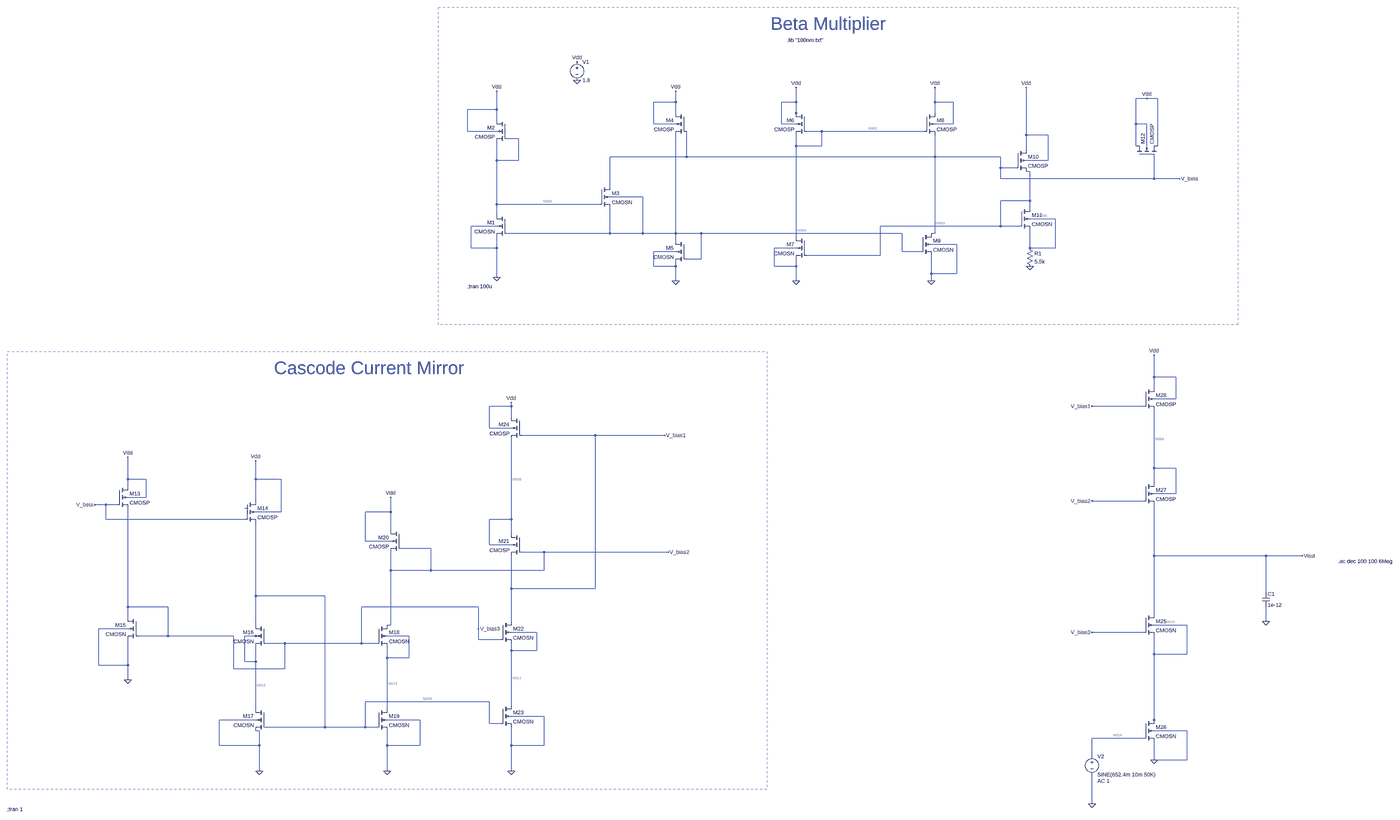
[diagram p0: schematic Vivek_180nm.asc, whole sheet]
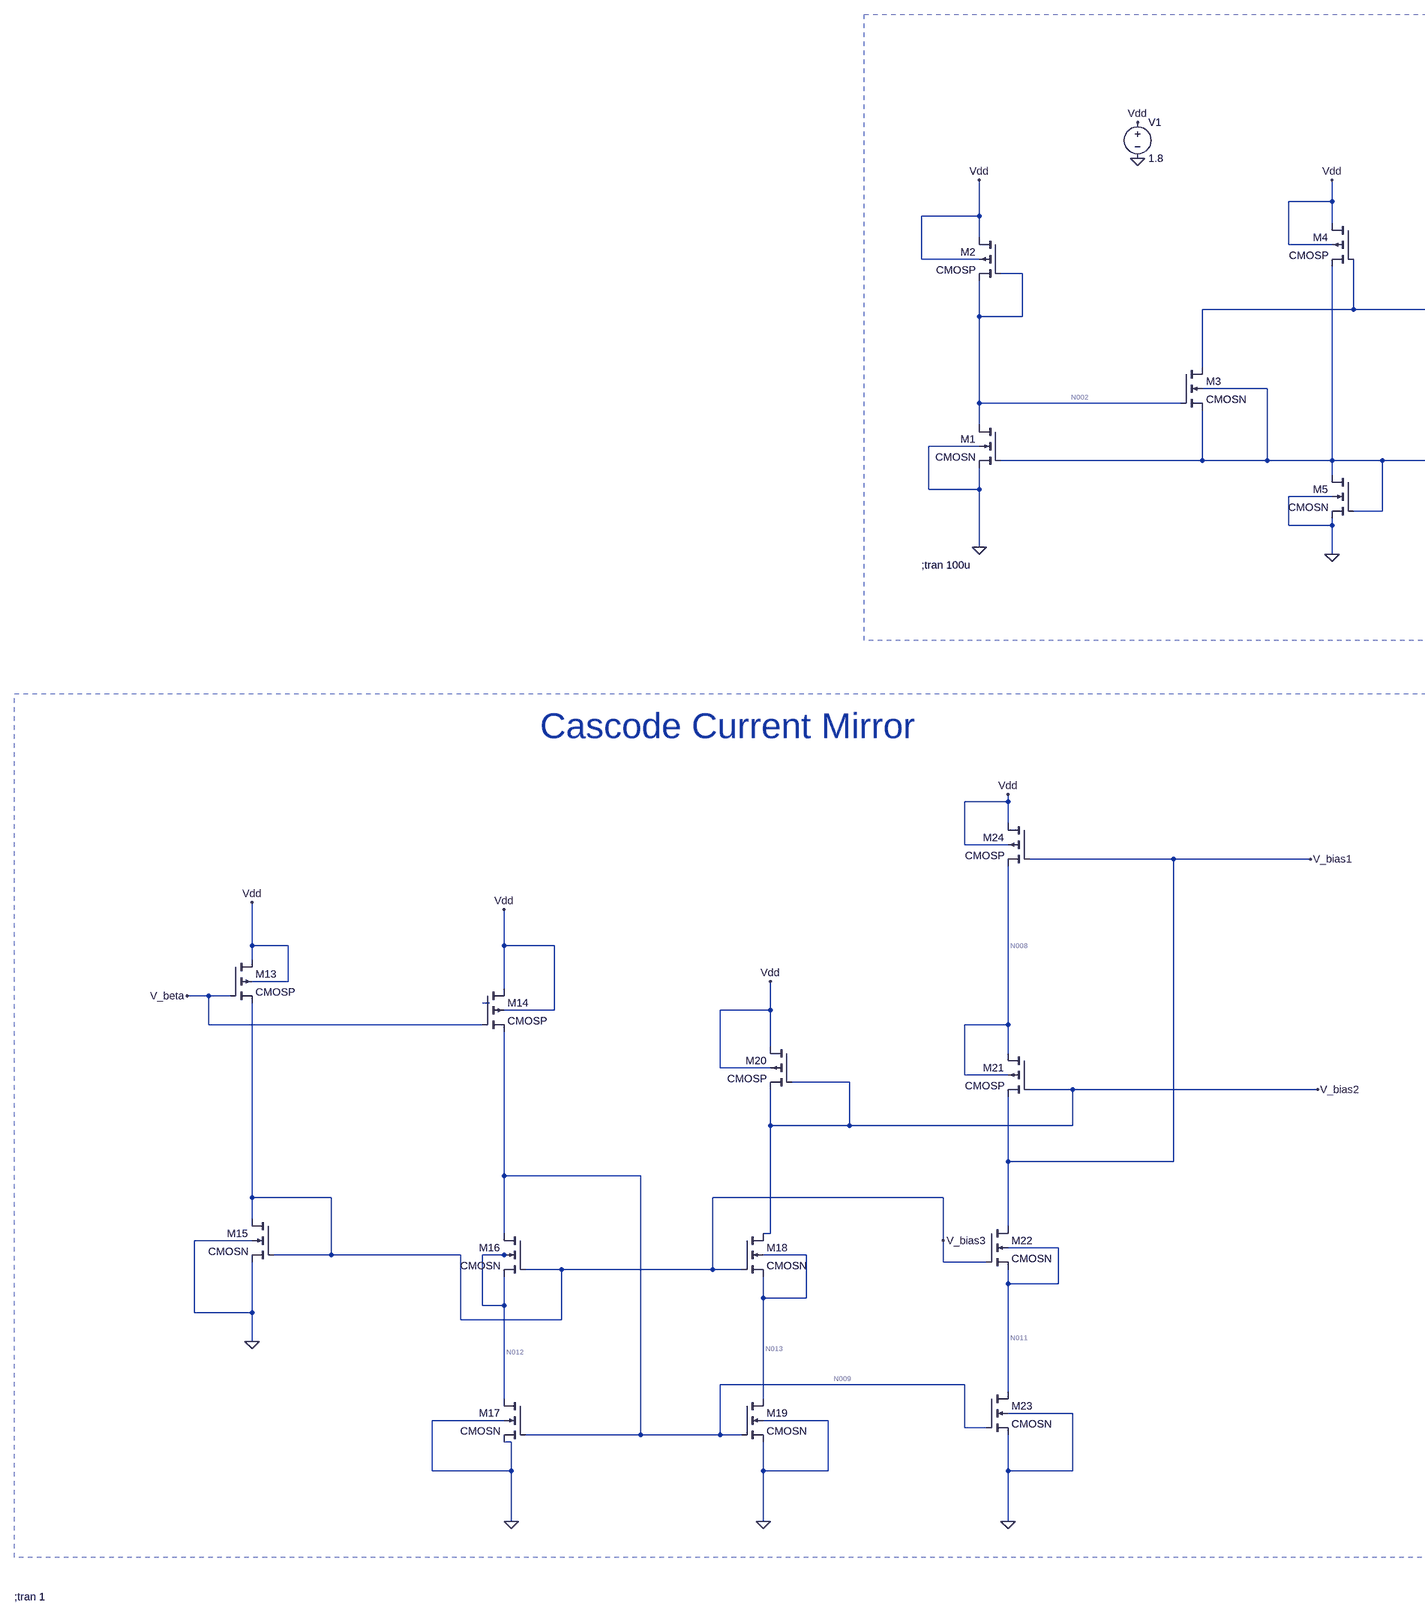
[diagram p1: schematic Vivek_180nm.asc, part, row 1 of 1, column 1 of 2]
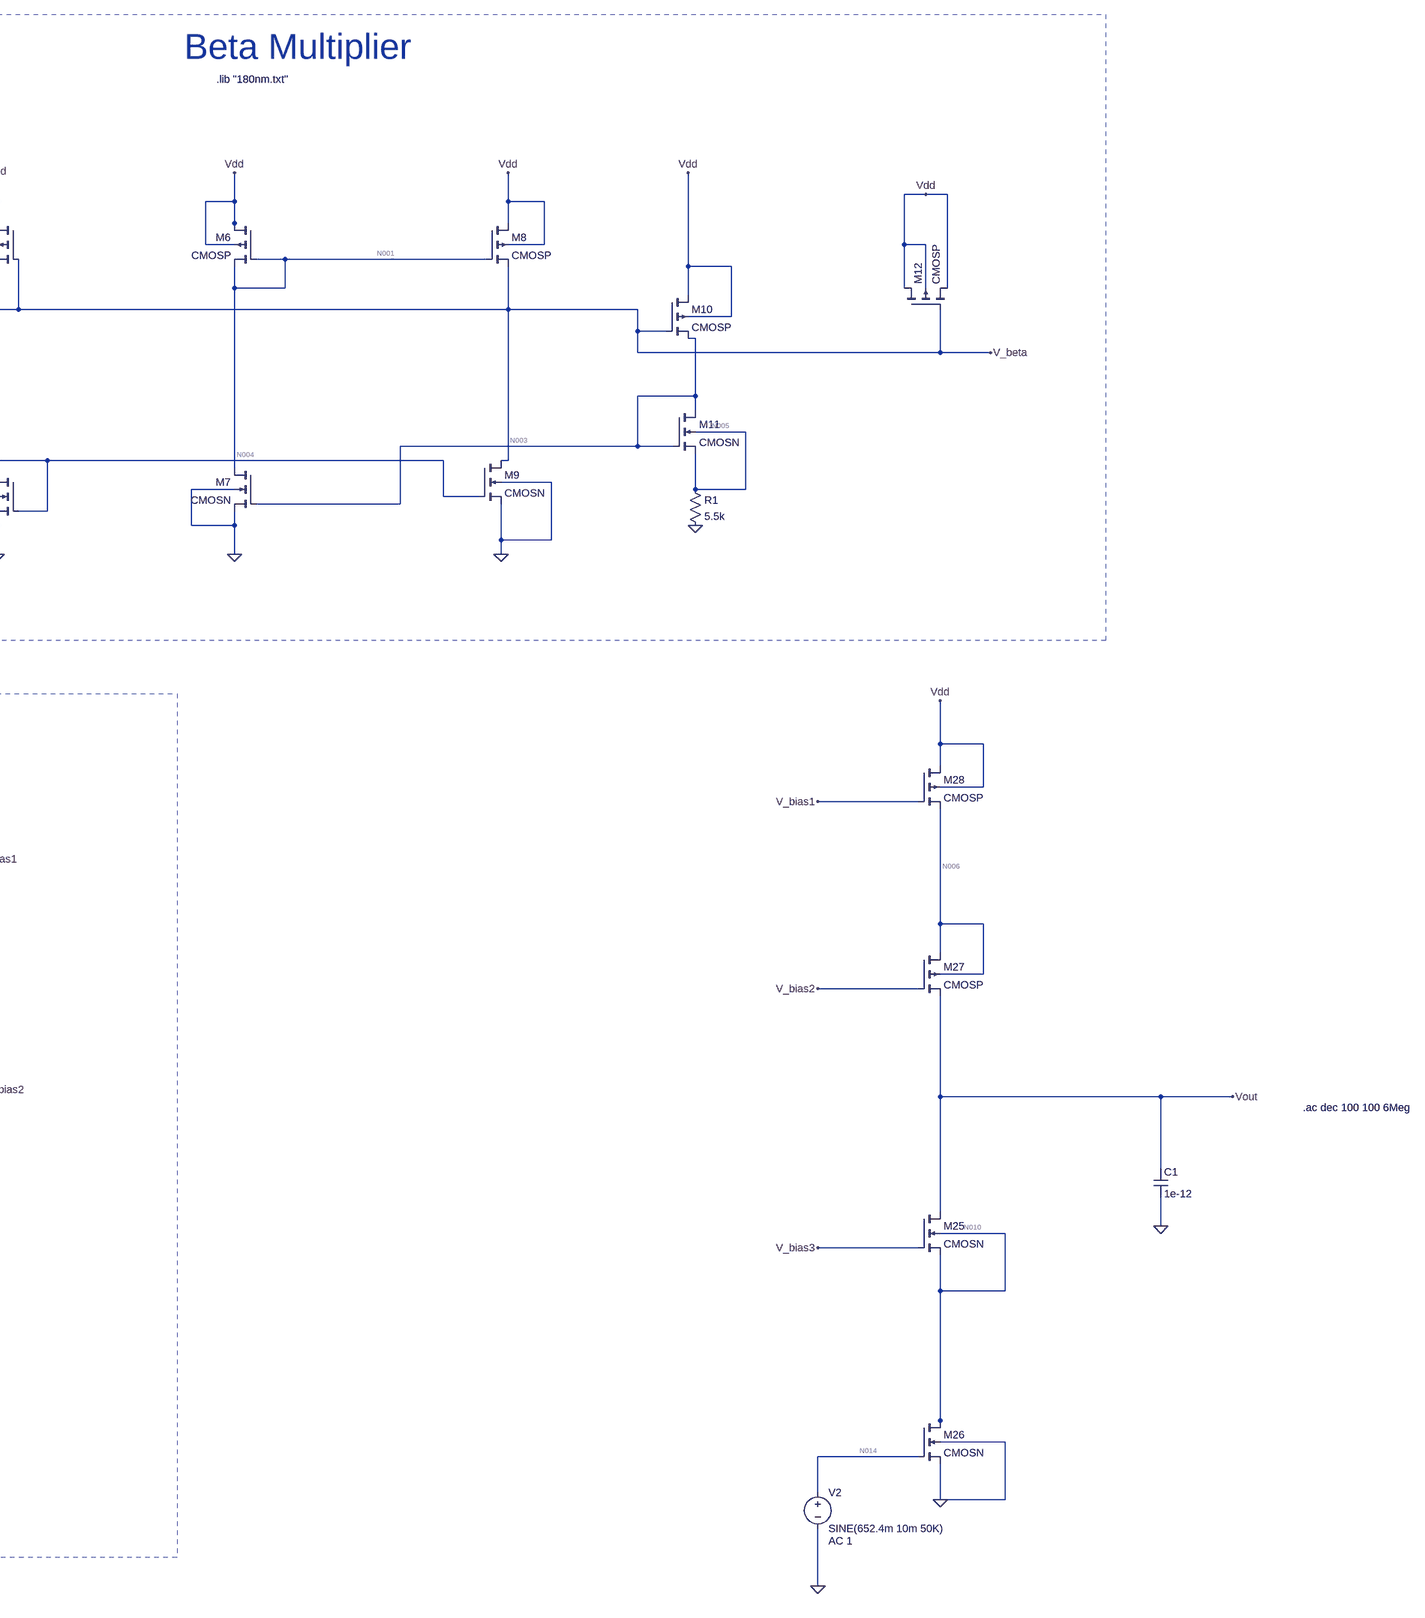
[diagram p2: schematic Vivek_180nm.asc, part, row 1 of 1, column 2 of 2]
Vivek_180nm.asc, the LTspice schematic file:
Version 4
SHEET 1 4504 2840
WIRE 2880 -432 2832 -432
WIRE 2928 -432 2880 -432
WIRE 816 -416 816 -464
WIRE 816 -416 720 -416
WIRE 1344 -416 1344 -480
WIRE 1344 -416 1280 -416
WIRE 1952 -416 1952 -480
WIRE 2032 -416 1952 -416
WIRE 32 -384 32 -464
WIRE 32 -384 -96 -384
WIRE 816 -368 816 -416
WIRE 1344 -368 1344 -416
WIRE 1952 -368 1952 -416
WIRE 1344 -352 1344 -368
WIRE 32 -336 32 -384
WIRE 720 -320 720 -416
WIRE 816 -320 720 -320
WIRE 1280 -320 1280 -416
WIRE 1344 -320 1280 -320
WIRE 2032 -320 2032 -416
WIRE 2032 -320 1952 -320
WIRE 2832 -320 2832 -432
WIRE 2880 -320 2832 -320
WIRE -96 -288 -96 -384
WIRE 32 -288 -96 -288
WIRE 1456 -288 1392 -288
WIRE 1904 -288 1456 -288
WIRE 2352 -272 2352 -480
WIRE 2448 -272 2352 -272
WIRE 128 -256 80 -256
WIRE 1344 -224 1344 -272
WIRE 1456 -224 1456 -288
WIRE 1456 -224 1344 -224
WIRE 2832 -224 2832 -320
WIRE 2880 -224 2880 -320
WIRE 2928 -224 2928 -432
WIRE 2352 -208 2352 -272
WIRE 864 -176 864 -288
WIRE 864 -176 528 -176
WIRE 1952 -176 1952 -272
WIRE 1952 -176 864 -176
WIRE 2240 -176 1952 -176
WIRE 32 -160 32 -240
WIRE 128 -160 128 -256
WIRE 128 -160 32 -160
WIRE 2448 -160 2448 -272
WIRE 2448 -160 2352 -160
WIRE 2240 -128 2240 -176
WIRE 2304 -128 2240 -128
WIRE 2368 -112 2352 -112
WIRE 2240 -80 2240 -128
WIRE 2912 -80 2912 -176
WIRE 2912 -80 2240 -80
WIRE 3024 -80 2912 -80
WIRE 528 -48 528 -176
WIRE 672 0 528 0
WIRE 2368 16 2368 -112
WIRE 2368 16 2240 16
WIRE 32 32 32 -160
WIRE 480 32 32 32
WIRE 2368 48 2368 16
WIRE 32 80 32 32
WIRE 2480 96 2368 96
WIRE 32 128 -80 128
WIRE 2240 128 2240 16
WIRE 2240 128 1712 128
WIRE 2320 128 2240 128
WIRE 528 160 528 48
WIRE 528 160 80 160
WIRE 672 160 672 0
WIRE 672 160 528 160
WIRE 816 160 816 -272
WIRE 816 160 672 160
WIRE 928 160 816 160
WIRE 1808 160 928 160
WIRE 1952 160 1952 -176
WIRE 1952 160 1936 160
WIRE 1344 176 1344 -224
WIRE 816 192 816 160
WIRE 2048 208 1936 208
WIRE -80 224 -80 128
WIRE 32 224 32 176
WIRE 32 224 -80 224
WIRE 1344 224 1248 224
WIRE 2368 224 2368 144
WIRE 2480 224 2480 96
WIRE 2480 224 2368 224
WIRE 816 240 720 240
WIRE 1808 240 1808 160
WIRE 1888 240 1808 240
WIRE 1712 256 1712 128
WIRE 1712 256 1392 256
WIRE 928 272 928 160
WIRE 928 272 864 272
WIRE 720 304 720 240
WIRE 816 304 816 288
WIRE 816 304 720 304
WIRE 1248 304 1248 224
WIRE 1344 304 1344 272
WIRE 1344 304 1248 304
WIRE 1936 336 1936 256
WIRE 2048 336 2048 208
WIRE 2048 336 1936 336
WIRE 32 352 32 224
WIRE 816 368 816 304
WIRE 1344 368 1344 304
WIRE 1936 368 1936 336
WIRE 2912 928 2912 832
WIRE 3008 928 2912 928
WIRE 2912 976 2912 928
WIRE 3008 1024 3008 928
WIRE 3008 1024 2912 1024
WIRE 96 1056 96 1040
WIRE 96 1056 0 1056
WIRE 2864 1056 2640 1056
WIRE 96 1104 96 1056
WIRE 0 1152 0 1056
WIRE 96 1152 0 1152
WIRE 464 1184 144 1184
WIRE 768 1184 464 1184
WIRE 2912 1328 2912 1072
WIRE 3008 1328 2912 1328
WIRE -1584 1376 -1584 1280
WIRE -1504 1376 -1584 1376
WIRE -1024 1376 -1024 1296
WIRE -912 1376 -1024 1376
WIRE 2912 1392 2912 1328
WIRE -1584 1408 -1584 1376
WIRE 3008 1440 3008 1328
WIRE 3008 1440 2912 1440
WIRE -1504 1456 -1504 1376
WIRE -1504 1456 -1584 1456
WIRE -1024 1472 -1024 1376
WIRE 2864 1472 2640 1472
WIRE -1680 1488 -1728 1488
WIRE -1632 1488 -1680 1488
WIRE -1056 1504 -1072 1504
WIRE -912 1520 -912 1376
WIRE -912 1520 -1024 1520
WIRE -432 1520 -432 1456
WIRE -432 1520 -544 1520
WIRE -1680 1552 -1680 1488
WIRE -1072 1552 -1680 1552
WIRE 96 1552 96 1200
WIRE 96 1552 0 1552
WIRE -432 1600 -432 1520
WIRE 96 1616 96 1552
WIRE -544 1648 -544 1520
WIRE -432 1648 -544 1648
WIRE 0 1664 0 1552
WIRE 96 1664 0 1664
WIRE -256 1680 -384 1680
WIRE 240 1696 144 1696
WIRE 784 1696 240 1696
WIRE 2912 1712 2912 1488
WIRE 3632 1712 2912 1712
WIRE 3792 1712 3632 1712
WIRE -432 1776 -432 1696
WIRE -256 1776 -256 1680
WIRE -256 1776 -432 1776
WIRE 240 1776 240 1696
WIRE 240 1776 -256 1776
WIRE 96 1856 96 1712
WIRE 464 1856 464 1184
WIRE 464 1856 96 1856
WIRE 3632 1872 3632 1712
WIRE -1024 1888 -1024 1568
WIRE -720 1888 -1024 1888
WIRE -1584 1936 -1584 1504
WIRE -1408 1936 -1584 1936
WIRE -48 1936 -560 1936
WIRE 2912 1968 2912 1712
WIRE -1584 1984 -1584 1936
WIRE 96 2000 96 1856
WIRE 3632 2000 3632 1936
WIRE -1024 2016 -1024 1888
WIRE -432 2016 -432 1776
WIRE -432 2016 -448 2016
WIRE 3056 2016 2912 2016
WIRE -1584 2032 -1712 2032
WIRE -48 2032 -48 1936
WIRE 208 2048 96 2048
WIRE 2864 2048 2640 2048
WIRE -1408 2064 -1408 1936
WIRE -1408 2064 -1536 2064
WIRE -1120 2064 -1408 2064
WIRE -1024 2064 -1072 2064
WIRE -1008 2064 -1024 2064
WIRE -352 2064 -448 2064
WIRE -48 2080 -48 2032
WIRE 48 2080 -48 2080
WIRE -896 2096 -976 2096
WIRE -560 2096 -560 1936
WIRE -560 2096 -896 2096
WIRE -496 2096 -560 2096
WIRE 96 2128 96 2096
WIRE 208 2128 208 2048
WIRE 208 2128 96 2128
WIRE 2912 2144 2912 2064
WIRE 3056 2144 3056 2016
WIRE 3056 2144 2912 2144
WIRE -448 2160 -448 2112
WIRE -352 2160 -352 2064
WIRE -352 2160 -448 2160
WIRE -1072 2176 -1072 2064
WIRE -1024 2176 -1024 2112
WIRE -1024 2176 -1072 2176
WIRE -1712 2192 -1712 2032
WIRE -1584 2192 -1584 2080
WIRE -1584 2192 -1712 2192
WIRE -1120 2208 -1120 2064
WIRE -896 2208 -896 2096
WIRE -896 2208 -1120 2208
WIRE -1584 2256 -1584 2192
WIRE 0 2352 -544 2352
WIRE 96 2368 96 2128
WIRE -1024 2384 -1024 2176
WIRE -448 2384 -448 2160
WIRE 240 2416 96 2416
WIRE -1024 2432 -1184 2432
WIRE -304 2432 -448 2432
WIRE 2912 2432 2912 2144
WIRE 0 2448 0 2352
WIRE 48 2448 0 2448
WIRE 2912 2448 2912 2432
WIRE -720 2464 -720 1888
WIRE -720 2464 -976 2464
WIRE -544 2464 -544 2352
WIRE -544 2464 -720 2464
WIRE -496 2464 -544 2464
WIRE -1008 2480 -1024 2480
WIRE 3056 2480 2912 2480
WIRE 2864 2512 2640 2512
WIRE -1184 2544 -1184 2432
WIRE -1008 2544 -1008 2480
WIRE -1008 2544 -1184 2544
WIRE -448 2544 -448 2480
WIRE -304 2544 -304 2432
WIRE -304 2544 -448 2544
WIRE 96 2544 96 2464
WIRE 240 2544 240 2416
WIRE 240 2544 96 2544
WIRE 2640 2592 2640 2512
WIRE 2912 2608 2912 2528
WIRE 3056 2608 3056 2480
WIRE 3056 2608 2912 2608
WIRE -1008 2656 -1008 2544
WIRE -448 2656 -448 2544
WIRE 96 2656 96 2544
WIRE 2640 2800 2640 2672
FLAG 1344 368 0
FLAG 1936 368 0
FLAG 2368 304 0
FLAG 816 368 0
FLAG 32 352 0
FLAG 816 -464 Vdd
FLAG 1344 -480 Vdd
FLAG 1952 -480 Vdd
FLAG 2352 -480 Vdd
FLAG 2880 -432 Vdd
FLAG 32 -464 Vdd
FLAG 384 -592 Vdd
FLAG 384 -512 0
FLAG 3024 -80 V_beta
FLAG -1584 2256 0
FLAG -1008 2656 0
FLAG -448 2656 0
FLAG 96 2656 0
FLAG -1584 1280 Vdd
FLAG -1024 1296 Vdd
FLAG -432 1456 Vdd
FLAG 96 1040 Vdd
FLAG -1728 1488 V_beta
FLAG 768 1184 V_bias1
FLAG 784 1696 V_bias2
FLAG 2640 1056 V_bias1
FLAG 2640 1472 V_bias2
FLAG 2640 2048 V_bias3
FLAG 2912 2608 0
FLAG 3632 2000 0
FLAG 2912 832 Vdd
FLAG 2640 2800 0
FLAG 3792 1712 Vout
FLAG -48 2032 V_bias3
SYMBOL nmos4 80 80 M0
SYMATTR InstName M1
SYMATTR Value CMOSN
SYMATTR Value2 l=360n w=1800n
SYMBOL pmos4 80 -336 M0
SYMATTR InstName M2
SYMATTR Value CMOSP
SYMATTR Value2 l=3600n w=1800n
SYMBOL nmos4 480 -48 R0
SYMATTR InstName M3
SYMATTR Value CMOSN
SYMATTR Value2 l=720n w=360n
SYMBOL pmos4 864 -368 M0
SYMATTR InstName M4
SYMATTR Value CMOSP
SYMATTR Value2 l=360n w=4320n
SYMBOL nmos4 864 192 M0
SYMATTR InstName M5
SYMATTR Value CMOSN
SYMATTR Value2 l=360n w=1800n
SYMBOL pmos4 1392 -368 M0
SYMATTR InstName M6
SYMATTR Value CMOSP
SYMATTR Value2 l=360n w=4320n
SYMBOL nmos4 1392 176 M0
SYMATTR InstName M7
SYMATTR Value CMOSN
SYMATTR Value2 l=360n w=1800n
SYMBOL pmos4 1904 -368 R0
SYMATTR InstName M8
SYMATTR Value CMOSP
SYMATTR Value2 l=360n w=4320n
SYMBOL nmos4 1888 160 R0
SYMATTR InstName M9
SYMATTR Value CMOSN
SYMATTR Value2 l=360n w=1800n
SYMBOL pmos4 2304 -208 R0
SYMATTR InstName M10
SYMATTR Value CMOSP
SYMATTR Value2 l=360n w=4320n
SYMBOL nmos4 2320 48 R0
SYMATTR InstName M11
SYMATTR Value CMOSN
SYMATTR Value2 l=360n w=5400n
SYMBOL res 2352 208 R0
SYMATTR InstName R1
SYMATTR Value 5.5k
SYMBOL pmos4 2832 -176 R270
SYMATTR InstName M12
SYMATTR Value CMOSP
SYMATTR Value2 l=9000n w=9000n
SYMBOL voltage 384 -608 R0
WINDOW 123 0 0 Left 0
WINDOW 39 0 0 Left 0
SYMATTR InstName V1
SYMATTR Value 1.8
SYMBOL pmos4 -1632 1408 R0
SYMATTR InstName M13
SYMATTR Value CMOSP
SYMATTR Value2 l=360n w=4320n
SYMBOL pmos4 -1072 1472 R0
SYMATTR InstName M14
SYMATTR Value CMOSP
SYMATTR Value2 l=360n w=4320n
SYMBOL nmos4 -1536 1984 M0
SYMATTR InstName M15
SYMATTR Value CMOSN
SYMATTR Value2 l=360n w=900n
SYMBOL nmos4 -976 2016 M0
SYMATTR InstName M16
SYMATTR Value CMOSN
SYMATTR Value2 l=360n w=1800n
SYMBOL nmos4 -976 2384 M0
SYMATTR InstName M17
SYMATTR Value CMOSN
SYMATTR Value2 l=360n w=1800n
SYMBOL nmos4 -496 2016 R0
SYMATTR InstName M18
SYMATTR Value CMOSN
SYMATTR Value2 l=360n w=1800n
SYMBOL nmos4 -496 2384 R0
SYMATTR InstName M19
SYMATTR Value CMOSN
SYMATTR Value2 l=360n w=1800n
SYMBOL pmos4 -384 1600 M0
SYMATTR InstName M20
SYMATTR Value CMOSP
SYMATTR Value2 l=900n w=3600n
SYMBOL pmos4 144 1616 M0
SYMATTR InstName M21
SYMATTR Value CMOSP
SYMATTR Value2 l=360n w=4320n
SYMBOL nmos4 48 2000 R0
SYMATTR InstName M22
SYMATTR Value CMOSN
SYMATTR Value2 l=360n w=1800n
SYMBOL nmos4 48 2368 R0
SYMATTR InstName M23
SYMATTR Value CMOSN
SYMATTR Value2 l=360n w=1800n
SYMBOL pmos4 144 1104 M0
SYMATTR InstName M24
SYMATTR Value CMOSP
SYMATTR Value2 l=360n w=4320n
SYMBOL nmos4 2864 1968 R0
SYMATTR InstName M25
SYMATTR Value CMOSN
SYMATTR Value2 l=360n w=1800n
SYMBOL nmos4 2864 2432 R0
SYMATTR InstName M26
SYMATTR Value CMOSN
SYMATTR Value2 l=360n w=1800n
SYMBOL pmos4 2864 1392 R0
SYMATTR InstName M27
SYMATTR Value CMOSP
SYMATTR Value2 l=360n w=3960n
SYMBOL pmos4 2864 976 R0
SYMATTR InstName M28
SYMATTR Value CMOSP
SYMATTR Value2 l=360n w=3960n
SYMBOL cap 3616 1872 R0
SYMATTR InstName C1
SYMATTR Value 1e-12
SYMBOL voltage 2640 2576 R0
WINDOW 123 24 124 Left 2
WINDOW 39 0 0 Left 0
SYMATTR Value2 AC 1
SYMATTR InstName V2
SYMATTR Value SINE(652.4m 10m 50K)
TEXT -96 392 Left 2 !;tran 100u
TEXT 1304 -688 Left 2 !.lib "180nm.txt"
TEXT 1232 -760 Left 6 ;Beta Multiplier
TEXT -944 888 Left 6 ;Cascode Current Mirror
TEXT -2112 2824 Left 2 !;tran 1
TEXT 4248 1736 Left 2 !.ac dec 100 100 6Meg
RECTANGLE Normal 3280 560 -224 -832 2
RECTANGLE Normal 1216 2736 -2112 816 2

The netlist it stands for:
* Vivek_180nm.asc
M1 N002 N004 0 0 CMOSN l=360n w=1800n
M2 Vdd N002 N002 Vdd CMOSP l=3600n w=1800n
M3 V_beta N002 N004 N004 CMOSN l=720n w=360n
M4 Vdd V_beta N004 Vdd CMOSP l=360n w=4320n
M5 N004 N004 0 0 CMOSN l=360n w=1800n
M6 Vdd N001 N001 Vdd CMOSP l=360n w=4320n
M7 N001 N003 0 0 CMOSN l=360n w=1800n
M8 Vdd N001 V_beta Vdd CMOSP l=360n w=4320n
M9 V_beta N004 0 0 CMOSN l=360n w=1800n
M10 Vdd V_beta N003 Vdd CMOSP l=360n w=4320n
M11 N003 N003 N005 N005 CMOSN l=360n w=5400n
R1 N005 0 5.5k
M12 Vdd V_beta Vdd Vdd CMOSP l=9000n w=9000n
V1 Vdd 0 1.8
M13 Vdd V_beta V_bias3 Vdd CMOSP l=360n w=4320n
M14 Vdd V_beta N009 Vdd CMOSP l=360n w=4320n
M15 V_bias3 V_bias3 0 0 CMOSN l=360n w=900n
M16 N009 V_bias3 N012 N012 CMOSN l=360n w=1800n
M17 N012 N009 0 0 CMOSN l=360n w=1800n
M18 V_bias2 V_bias3 N013 N013 CMOSN l=360n w=1800n
M19 N013 N009 0 0 CMOSN l=360n w=1800n
M20 Vdd V_bias2 V_bias2 Vdd CMOSP l=900n w=3600n
M21 N008 V_bias2 V_bias1 N008 CMOSP l=360n w=4320n
M22 V_bias1 V_bias3 N011 N011 CMOSN l=360n w=1800n
M23 N011 N009 0 0 CMOSN l=360n w=1800n
M24 Vdd V_bias1 N008 Vdd CMOSP l=360n w=4320n
M25 Vout V_bias3 N010 N010 CMOSN l=360n w=1800n
M26 N010 N014 0 0 CMOSN l=360n w=1800n
M27 N006 V_bias2 Vout N006 CMOSP l=360n w=3960n
M28 Vdd V_bias1 N006 Vdd CMOSP l=360n w=3960n
C1 Vout 0 1e-12
V2 N014 0 SINE(652.4m 10m 50K) AC 1
.model NMOS NMOS
.model PMOS PMOS
.lib standard.mos
;tran 100u
.lib "180nm.txt"
* Beta Multiplier
* Cascode Current Mirror
;tran 1
.ac dec 100 100 6Meg
.backanno
.end

* Results of the author's LTspice run, read from the files saved beside the schematic
* Operating Point, zero values left out:
*   V(n002) = 443.6 mV
*   V(n004) = 581.1 mV
*   V(vdd) = 1.8 V
*   V(v_beta) = 1.197 V
*   V(n001) = 1.183 V
*   V(n003) = 581.4 mV
*   V(n005) = 61.29 mV
*   V(v_bias3) = 629 mV
*   V(n009) = 652.4 mV
*   V(n012) = 48.7 mV
*   V(v_bias2) = 1.066 V
*   V(n013) = 50.76 mV
*   V(n008) = 1.679 V
*   V(v_bias1) = 1.166 V
*   V(n011) = 51.23 mV
*   V(vout) = 410 mV
*   V(n010) = 47.16 mV
*   V(n014) = 652.4 mV
*   V(n006) = 1.673 V
*   Id(M1) = 10.86 µA
*   Is(M1) = -10.86 µA
*   Id(M5) = 11.14 µA
*   Is(M5) = -11.14 µA
*   Id(M7) = 12.23 µA
*   Ib(M7) = -1.193 pA
*   Is(M7) = -12.23 µA
*   Id(M9) = 12.21 µA
*   Ib(M9) = -1.207 pA
*   Is(M9) = -12.21 µA
*   Id(M11) = 11.14 µA
*   Is(M11) = -11.14 µA
*   Id(M15) = 11.09 µA
*   Is(M15) = -11.09 µA
*   Id(M16) = 11.07 µA
*   Is(M16) = -11.07 µA
*   Id(M17) = 11.07 µA
*   Is(M17) = -11.07 µA
*   Id(M18) = 11.44 µA
*   Ib(M18) = -1.025 pA
*   Is(M18) = -11.44 µA
*   Id(M19) = 11.44 µA
*   Is(M19) = -11.44 µA
*   Id(M22) = 11.53 µA
*   Ib(M22) = -1.125 pA
*   Is(M22) = -11.53 µA
*   Id(M23) = 11.53 µA
*   Is(M23) = -11.53 µA
*   Id(M25) = 10.78 µA
*   Is(M25) = -10.78 µA
*   Id(M26) = 10.78 µA
*   Is(M26) = -10.78 µA
*   Id(M2) = 10.86 µA
*   Ib(M2) = 1.366 pA
*   Is(M2) = -10.86 µA
*   Id(M4) = 11.14 µA
*   Ib(M4) = 1.229 pA
*   Is(M4) = -11.14 µA
*   Id(M6) = 12.23 µA
*   Is(M6) = -12.23 µA
*   Id(M8) = 12.21 µA
*   Is(M8) = -12.21 µA
*   Id(M10) = 11.14 µA
*   Ib(M10) = 1.229 pA
*   Is(M10) = -11.14 µA
*   Id(M13) = 11.09 µA
*   Ib(M13) = 1.181 pA
*   Is(M13) = -11.09 µA
*   Id(M14) = 11.07 µA
*   Ib(M14) = 1.158 pA
*   Is(M14) = -11.07 µA
*   Id(M20) = 11.44 µA
*   Is(M20) = -11.44 µA
*   Id(M21) = 11.53 µA
*   Is(M21) = -11.53 µA
*   Id(M24) = 11.53 µA
*   Is(M24) = -11.53 µA
*   Id(M27) = 10.78 µA
*   Ib(M27) = 1.273 pA
*   Is(M27) = -10.78 µA
*   Id(M28) = 10.78 µA
*   Is(M28) = -10.78 µA
*   I(R1) = 11.14 µA
*   I(V1) = -113.5 µA
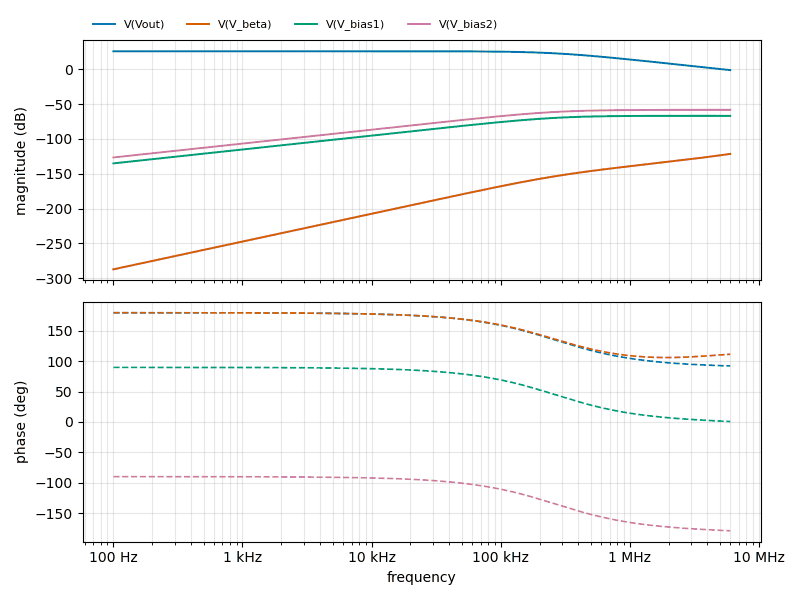
[diagram p3: AC Analysis of Vivek_180nm.asc, plotted from the saved traces]
* AC Analysis, 1 run:
*   V(Vout): 26.09 dB at 100 Hz, -1.03 dB at 6 MHz, peak 26.09 dB at 100 Hz, 3 dB below the peak at 264.6 kHz
*   V(V_beta): -287.46 dB at 100 Hz, -121.48 dB at 6 MHz, peak -121.48 dB at 6 MHz, 3 dB below the peak at 4.585 MHz
*   V(V_bias1): -135.11 dB at 100 Hz, -66.80 dB at 6 MHz, peak -66.72 dB at 2.951 MHz, 3 dB below the peak at 260.5 kHz
*   V(V_bias2): -126.61 dB at 100 Hz, -58.06 dB at 6 MHz, peak -58.06 dB at 6 MHz, 3 dB below the peak at 270.2 kHz